# Vivado block design design_1, xczu4ev-sfvc784-1-i, Vivado 2021.1
# (continued, part 2 of 3)
current_bd_instance /user_i2c

# ---- hierarchy /Debug ----
current_bd_instance /Debug
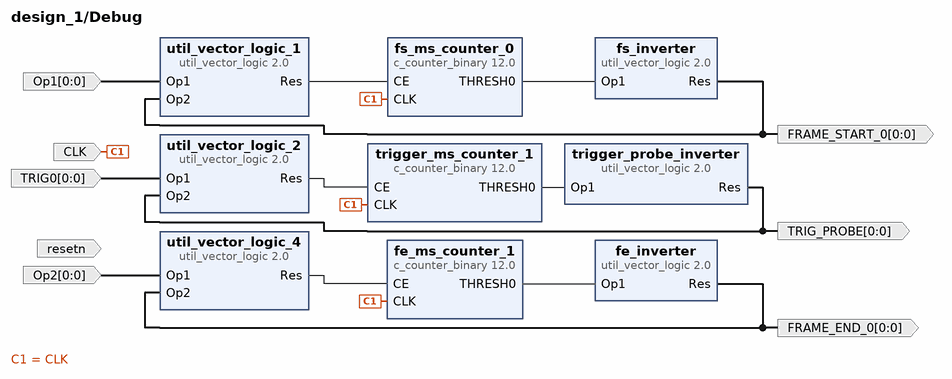
[diagram p12: block diagram inside /Debug]
create_bd_pin -dir O -from 0 -to 0 FRAME_START_0
create_bd_pin -dir O -from 0 -to 0 TRIG_PROBE
create_bd_pin -dir I -from 0 -to 0 Op1
create_bd_pin -dir O -from 0 -to 0 FRAME_END_0
create_bd_pin -dir I -from 0 -to 0 TRIG0
create_bd_pin -dir I -from 0 -to 0 Op2
create_bd_pin -dir I -type clk CLK
create_bd_pin -dir I -type rst resetn

create_bd_cell -type ip -vlnv xilinx.com:ip:util_vector_logic:2.0 fs_inverter
set_property -dict {CONFIG.C_OPERATION not CONFIG.C_SIZE 1} [get_bd_cells fs_inverter]
create_bd_cell -type ip -vlnv xilinx.com:ip:util_vector_logic:2.0 trigger_probe_inverter
set_property -dict {CONFIG.C_OPERATION not CONFIG.C_SIZE 1} [get_bd_cells trigger_probe_inverter]
create_bd_cell -type ip -vlnv xilinx.com:ip:util_vector_logic:2.0 util_vector_logic_1
set_property -dict {CONFIG.C_OPERATION or CONFIG.C_SIZE 1} [get_bd_cells util_vector_logic_1]
create_bd_cell -type ip -vlnv xilinx.com:ip:util_vector_logic:2.0 fe_inverter
set_property -dict {CONFIG.C_OPERATION not CONFIG.C_SIZE 1} [get_bd_cells fe_inverter]
create_bd_cell -type ip -vlnv xilinx.com:ip:util_vector_logic:2.0 util_vector_logic_2
set_property -dict {CONFIG.C_OPERATION or CONFIG.C_SIZE 1} [get_bd_cells util_vector_logic_2]
create_bd_cell -type ip -vlnv xilinx.com:ip:util_vector_logic:2.0 util_vector_logic_4
set_property -dict {CONFIG.C_OPERATION or CONFIG.C_SIZE 1} [get_bd_cells util_vector_logic_4]
create_bd_cell -type ip -vlnv xilinx.com:ip:c_counter_binary:12.0 trigger_ms_counter_1
set_property -dict [list \
  CONFIG.CE true \
  CONFIG.Final_Count_Value 186A0 \
  CONFIG.Implementation Fabric \
  CONFIG.Load false \
  CONFIG.Output_Width 17 \
  CONFIG.Restrict_Count true \
  CONFIG.SCLR false \
  CONFIG.Sync_Threshold_Output true \
  CONFIG.Threshold_Value 18699 \
] [get_bd_cells trigger_ms_counter_1]
create_bd_cell -type ip -vlnv xilinx.com:ip:c_counter_binary:12.0 fe_ms_counter_1
set_property -dict [list \
  CONFIG.CE true \
  CONFIG.Final_Count_Value 186A0 \
  CONFIG.Implementation Fabric \
  CONFIG.Load false \
  CONFIG.Output_Width 17 \
  CONFIG.Restrict_Count true \
  CONFIG.SCLR false \
  CONFIG.Sync_Threshold_Output true \
  CONFIG.Threshold_Value 18699 \
] [get_bd_cells fe_ms_counter_1]
create_bd_cell -type ip -vlnv xilinx.com:ip:c_counter_binary:12.0 fs_ms_counter_0
set_property -dict [list \
  CONFIG.CE true \
  CONFIG.Final_Count_Value 186A0 \
  CONFIG.Implementation Fabric \
  CONFIG.Load false \
  CONFIG.Output_Width 17 \
  CONFIG.Restrict_Count true \
  CONFIG.SCLR false \
  CONFIG.Sync_Threshold_Output true \
  CONFIG.Threshold_Value 18699 \
] [get_bd_cells fs_ms_counter_0]

# ---- connections ----

current_bd_instance /GPIO
connect_bd_net [get_bd_pins GPIO] [get_bd_pins util_ds_buf_0/IOBUF_IO_IO]
connect_bd_net [get_bd_pins USER_DIP] [get_bd_pins gpi_concat/In1]
connect_bd_net [get_bd_pins cam_enable_slice/Dout] [get_bd_pins ENABLE]
connect_bd_net [get_bd_pins gpi_concat/dout] [get_bd_pins dout]
connect_bd_net [get_bd_pins gpio_i_slice/Dout] [get_bd_pins util_ds_buf_0/IOBUF_IO_I]
connect_bd_net [get_bd_pins gpio_t_slice/Dout] [get_bd_pins util_ds_buf_0/IOBUF_IO_T]
connect_bd_net [get_bd_pins gpio_trigger_slice/Dout] [get_bd_pins TRIG0]
connect_bd_net [get_bd_pins user_led_slice/Dout] [get_bd_pins USER_LEDS]
connect_bd_net [get_bd_pins util_ds_buf_0/IOBUF_IO_O] [get_bd_pins gpi_concat/In2]
connect_bd_net -net zynq_ultra_ps_e_0_emio_gpio_o [get_bd_pins Din] \
  [get_bd_pins cam_enable_slice/Din] [get_bd_pins user_led_slice/Din] [get_bd_pins gpio_i_slice/Din] \
  [get_bd_pins gpio_trigger_slice/Din]
connect_bd_net -net zynq_ultra_ps_e_0_emio_gpio_t [get_bd_pins Din1] [get_bd_pins gpio_t_slice/Din]

current_bd_instance /mipi
connect_bd_intf_net [get_bd_intf_pins M_AXI_S2MM4] [get_bd_intf_pins cam1/M_AXI_S2MM]
connect_bd_intf_net [get_bd_intf_pins M_AXI_S2MM] [get_bd_intf_pins cam5/M_AXI_S2MM]
connect_bd_intf_net [get_bd_intf_pins iic_rtl_3] [get_bd_intf_pins cam3/iic_rtl_3]
connect_bd_intf_net [get_bd_intf_pins S_AXI] [get_bd_intf_pins line_counter/S_AXI]
connect_bd_intf_net [get_bd_intf_pins S_AXI2] [get_bd_intf_pins trigger_timer/S_AXI]
connect_bd_intf_net [get_bd_intf_pins M_AXI_S2MM1] [get_bd_intf_pins cam2/M_AXI_S2MM]
connect_bd_intf_net [get_bd_intf_pins M_AXI_S2MM2] [get_bd_intf_pins cam3/M_AXI_S2MM]
connect_bd_intf_net [get_bd_intf_pins M_AXI_S2MM3] [get_bd_intf_pins cam4/M_AXI_S2MM]
connect_bd_intf_net [get_bd_intf_pins M_AXI_S2MM5] [get_bd_intf_pins cam0/M_AXI_S2MM]
connect_bd_intf_net [get_bd_intf_pins M_AXI_S2MM6] [get_bd_intf_pins Downscaler/M_AXI_S2MM]
connect_bd_intf_net [get_bd_intf_pins S_AXI_LITE6] [get_bd_intf_pins Downscaler/S_AXI_LITE]
connect_bd_intf_net [get_bd_intf_pins M_AXI_S2MM7] [get_bd_intf_pins Downscaler/M_AXI_S2MM1]
connect_bd_intf_net [get_bd_intf_pins S_AXI_LITE7] [get_bd_intf_pins Downscaler/S_AXI_LITE1]
connect_bd_intf_net [get_bd_intf_pins M_AXI_S2MM8] [get_bd_intf_pins Downscaler/M_AXI_S2MM2]
connect_bd_intf_net [get_bd_intf_pins S_AXI_LITE8] [get_bd_intf_pins Downscaler/S_AXI_LITE2]
connect_bd_intf_net [get_bd_intf_pins M_AXI_S2MM9] [get_bd_intf_pins Downscaler/M_AXI_S2MM3]
connect_bd_intf_net [get_bd_intf_pins S_AXI_LITE9] [get_bd_intf_pins Downscaler/S_AXI_LITE3]
connect_bd_intf_net [get_bd_intf_pins M_AXI_S2MM10] [get_bd_intf_pins Downscaler/M_AXI_S2MM4]
connect_bd_intf_net [get_bd_intf_pins S_AXI_LITE10] [get_bd_intf_pins Downscaler/S_AXI_LITE4]
connect_bd_intf_net [get_bd_intf_pins s_axi_ctrl] [get_bd_intf_pins Downscaler/s_axi_ctrl]
connect_bd_intf_net [get_bd_intf_pins s_axi_ctrl1] [get_bd_intf_pins Downscaler/s_axi_ctrl1]
connect_bd_intf_net [get_bd_intf_pins s_axi_ctrl2] [get_bd_intf_pins Downscaler/s_axi_ctrl2]
connect_bd_intf_net [get_bd_intf_pins s_axi_ctrl3] [get_bd_intf_pins Downscaler/s_axi_ctrl3]
connect_bd_intf_net [get_bd_intf_pins s_axi_ctrl4] [get_bd_intf_pins Downscaler/s_axi_ctrl4]
connect_bd_intf_net [get_bd_intf_pins iic_rtl_1] [get_bd_intf_pins cam1/iic_rtl_1]
connect_bd_intf_net [get_bd_intf_pins iic_rtl_4] [get_bd_intf_pins cam4/iic_rtl_4]
connect_bd_intf_net [get_bd_intf_pins iic_rtl_5] [get_bd_intf_pins cam5/iic_rtl_5]
connect_bd_intf_net [get_bd_intf_pins cam0/M01_AXIS] [get_bd_intf_pins Downscaler/S00_AXIS]
connect_bd_intf_net [get_bd_intf_pins cam1/M01_AXIS] [get_bd_intf_pins Downscaler/S01_AXIS]
connect_bd_intf_net [get_bd_intf_pins cam2/M01_AXIS] [get_bd_intf_pins Downscaler/S02_AXIS]
connect_bd_intf_net [get_bd_intf_pins iic_rtl_2] [get_bd_intf_pins cam2/iic_rtl_2]
connect_bd_intf_net [get_bd_intf_pins cam3/M01_AXIS] [get_bd_intf_pins Downscaler/S03_AXIS]
connect_bd_intf_net [get_bd_intf_pins cam4/M01_AXIS] [get_bd_intf_pins Downscaler/S04_AXIS]
connect_bd_intf_net [get_bd_intf_pins cam5/M01_AXIS] [get_bd_intf_pins Downscaler/S05_AXIS]
connect_bd_intf_net [get_bd_intf_pins mipi_phy_if_0] [get_bd_intf_pins cam0/mipi_phy_if_0]
connect_bd_intf_net [get_bd_intf_pins mipi_phy_if_1] [get_bd_intf_pins cam1/mipi_phy_if_1]
connect_bd_intf_net [get_bd_intf_pins mipi_phy_if_2] [get_bd_intf_pins cam2/mipi_phy_if_2]
connect_bd_intf_net [get_bd_intf_pins mipi_phy_if_3] [get_bd_intf_pins cam3/mipi_phy_if_3]
connect_bd_intf_net [get_bd_intf_pins mipi_phy_if_4] [get_bd_intf_pins cam4/mipi_phy_if_4]
connect_bd_intf_net [get_bd_intf_pins mipi_phy_if_5] [get_bd_intf_pins cam5/mipi_phy_if_5]
connect_bd_intf_net [get_bd_intf_pins S_AXI_LITE5] [get_bd_intf_pins cam0/S_AXI_LITE]
connect_bd_intf_net [get_bd_intf_pins S_AXI_LITE] [get_bd_intf_pins cam1/S_AXI_LITE]
connect_bd_intf_net [get_bd_intf_pins S_AXI1] [get_bd_intf_pins cam1/S_AXI1]
connect_bd_intf_net [get_bd_intf_pins S_AXI8] [get_bd_intf_pins cam2/S_AXI]
connect_bd_intf_net [get_bd_intf_pins S_AXI10] [get_bd_intf_pins cam3/S_AXI1]
connect_bd_intf_net [get_bd_intf_pins S_AXI12] [get_bd_intf_pins cam4/S_AXI1]
connect_bd_intf_net [get_bd_intf_pins S_AXI6] [get_bd_intf_pins cam5/S_AXI1]
connect_bd_intf_net [get_bd_intf_pins S_AXI_LITE2] [get_bd_intf_pins cam2/S_AXI_LITE]
connect_bd_intf_net [get_bd_intf_pins S_AXI_LITE3] [get_bd_intf_pins cam3/S_AXI_LITE]
connect_bd_intf_net [get_bd_intf_pins S_AXI_LITE4] [get_bd_intf_pins cam4/S_AXI_LITE]
connect_bd_intf_net [get_bd_intf_pins S_AXI_LITE1] [get_bd_intf_pins cam5/S_AXI_LITE]
connect_bd_net [get_bd_pins Din] [get_bd_pins line_counter_select/Din] [get_bd_pins Downscaler/Din]
connect_bd_net [get_bd_pins aresetn] [get_bd_pins Downscaler/aresetn]
connect_bd_net -net axi_vdma_1_s2mm_introut [get_bd_pins cam1/s2mm_introut] [get_bd_pins s2mm_introut]
connect_bd_net -net axi_vdma_2_s2mm_introut1 [get_bd_pins cam2/s2mm_introut] [get_bd_pins s2mm_introut2]
connect_bd_net -net axi_vdma_3_s2mm_introut [get_bd_pins cam3/s2mm_introut] [get_bd_pins s2mm_introut3]
connect_bd_net -net axi_vdma_4_s2mm_introut [get_bd_pins cam4/s2mm_introut] [get_bd_pins s2mm_introut4]
connect_bd_net -net axi_vdma_5_s2mm_introut [get_bd_pins cam5/s2mm_introut] [get_bd_pins s2mm_introut1]
connect_bd_net [get_bd_pins cam0/video_out_tlast] [get_bd_pins end_line_concat/In0]
connect_bd_net [get_bd_pins cam1/video_out_tlast] [get_bd_pins end_line_concat/In1]
connect_bd_net -net cam2_mipi_block_two_lane_iic2intc_irpt [get_bd_pins cam2/iic2intc_irpt] [get_bd_pins iic2intc_irpt5]
connect_bd_net [get_bd_pins cam2/video_out_tlast] [get_bd_pins end_line_concat/In2]
connect_bd_net [get_bd_pins cam3/video_out_tlast] [get_bd_pins end_line_concat/In3]
connect_bd_net [get_bd_pins cam4/video_out_tlast] [get_bd_pins end_line_concat/In4]
connect_bd_net [get_bd_pins cam5/video_out_tlast] [get_bd_pins end_line_concat/In5]
connect_bd_net -net cam_iic_1_iic2intc_irpt [get_bd_pins cam1/iic2intc_irpt] [get_bd_pins iic2intc_irpt]
connect_bd_net -net cam_iic_3_iic2intc_irpt [get_bd_pins cam3/iic2intc_irpt] [get_bd_pins iic2intc_irpt6]
connect_bd_net -net cam_iic_4_iic2intc_irpt [get_bd_pins cam4/iic2intc_irpt] [get_bd_pins iic2intc_irpt7]
connect_bd_net -net cam_iic_5_iic2intc_irpt [get_bd_pins cam5/iic2intc_irpt] [get_bd_pins iic2intc_irpt4]
connect_bd_net [get_bd_pins end_line_concat/dout] [get_bd_pins selector/Op1]
connect_bd_net -net end_of_line_select_Dout [get_bd_pins line_counter_select/Dout] [get_bd_pins selector/Op2]
connect_bd_net [get_bd_pins line_counter/interrupt] [get_bd_pins interrupt6]
connect_bd_net [get_bd_pins line_end_inverter/Res] [get_bd_pins line_counter/freeze]
connect_bd_net -net mipi_block_four_lane_frame_rcvd_pulse_out [get_bd_pins cam0/frame_rcvd_pulse_out] [get_bd_pins frame_rcvd_pulse_out]
connect_bd_net -net mipi_block_four_lane_s2mm_introut [get_bd_pins cam0/s2mm_introut] [get_bd_pins s2mm_introut5]
connect_bd_net -net mipi_csi2_rx_subsyst_0_clkoutphy_out [get_bd_pins cam1/clkoutphy_out] \
  [get_bd_pins cam2/clkoutphy_in] [get_bd_pins cam4/clkoutphy_in] [get_bd_pins cam5/clkoutphy_in] [get_bd_pins clkoutphy_out]
connect_bd_net -net mipi_csi2_rx_subsyst_0_pll_lock_out [get_bd_pins cam1/pll_lock_out] \
  [get_bd_pins cam2/pll_lock_in] [get_bd_pins cam4/pll_lock_in] [get_bd_pins cam5/pll_lock_in]
connect_bd_net -net mipi_csi2_rx_subsyst_0_video_out_tuser [get_bd_pins cam0/video_out_tuser] [get_bd_pins video_out_tuser]
connect_bd_net [get_bd_pins reduce_line_counters/Res] [get_bd_pins line_end_inverter/Op1]
connect_bd_net -net rst_ps8_0_49M_peripheral_aresetn [get_bd_pins video_aresetn] \
  [get_bd_pins cam0/video_aresetn] [get_bd_pins cam2/video_aresetn] [get_bd_pins cam3/s_axi_aresetn] \
  [get_bd_pins cam4/video_aresetn] [get_bd_pins cam5/video_aresetn] [get_bd_pins cam1/axi_resetn] \
  [get_bd_pins line_counter/s_axi_aresetn] [get_bd_pins trigger_timer/s_axi_aresetn] \
  [get_bd_pins Downscaler/peripheral_aresetn]
connect_bd_net [get_bd_pins trigger_timer/pwm0] [get_bd_pins TRIG1]
connect_bd_net -net util_vector_logic_0_Res1 [get_bd_pins selector/Res] [get_bd_pins reduce_line_counters/Op1]
connect_bd_net [get_bd_pins xlconstant_0/dout] \
  [get_bd_pins cam0/ctrl_core_en] [get_bd_pins cam2/ctrl_core_en] [get_bd_pins cam3/ctrl_core_en] \
  [get_bd_pins cam4/ctrl_core_en] [get_bd_pins cam5/ctrl_core_en] [get_bd_pins cam1/ctrl_core_en]
connect_bd_net [get_bd_pins xlconstant_1/dout] [get_bd_pins dout1]
connect_bd_net [get_bd_pins xlconstant_2/dout] [get_bd_pins dout]
connect_bd_net -net zynq_ultra_ps_e_0_pl_clk0 [get_bd_pins dphy_clk_200M] \
  [get_bd_pins cam0/dphy_clk_200M] [get_bd_pins cam2/dphy_clk_200M] [get_bd_pins cam3/dphy_clk_200M] \
  [get_bd_pins cam4/dphy_clk_200M] [get_bd_pins cam5/dphy_clk_200M] [get_bd_pins cam1/dphy_clk_200M]
connect_bd_net -net zynq_ultra_ps_e_0_pl_clk1 [get_bd_pins video_aclk] \
  [get_bd_pins cam0/video_aclk] [get_bd_pins cam2/video_aclk] [get_bd_pins cam3/s_axi_aclk] [get_bd_pins cam4/video_aclk] \
  [get_bd_pins cam5/video_aclk] [get_bd_pins cam1/s_axi_lite_aclk] [get_bd_pins line_counter/s_axi_aclk] \
  [get_bd_pins trigger_timer/s_axi_aclk] [get_bd_pins Downscaler/pl_clk1] [get_bd_pins Downscaler/pl_clk0]

current_bd_instance /mipi/cam1
connect_bd_intf_net [get_bd_intf_pins iic_rtl_1] [get_bd_intf_pins iic/IIC]
connect_bd_intf_net [get_bd_intf_pins M_AXI_S2MM] [get_bd_intf_pins axi_vdma/M_AXI_S2MM]
connect_bd_intf_net [get_bd_intf_pins axis_broadcaster/M00_AXIS] [get_bd_intf_pins axi_vdma/S_AXIS_S2MM]
connect_bd_intf_net [get_bd_intf_pins M01_AXIS] [get_bd_intf_pins axis_broadcaster/M01_AXIS]
connect_bd_intf_net [get_bd_intf_pins mipi_csi2_rx_subsystem/video_out] [get_bd_intf_pins axis_broadcaster/S_AXIS]
connect_bd_intf_net [get_bd_intf_pins mipi_phy_if_1] [get_bd_intf_pins mipi_csi2_rx_subsystem/mipi_phy_if]
connect_bd_intf_net [get_bd_intf_pins S_AXI_LITE] [get_bd_intf_pins axi_vdma/S_AXI_LITE]
connect_bd_intf_net [get_bd_intf_pins S_AXI1] [get_bd_intf_pins iic/S_AXI]
connect_bd_net -net axi_vdma_1_s2mm_introut [get_bd_pins axi_vdma/s2mm_introut] [get_bd_pins s2mm_introut]
connect_bd_net -net cam_iic_1_iic2intc_irpt [get_bd_pins iic/iic2intc_irpt] [get_bd_pins iic2intc_irpt]
connect_bd_net -net mipi_csi2_rx_subsyst_0_clkoutphy_out [get_bd_pins mipi_csi2_rx_subsystem/clkoutphy_out] [get_bd_pins clkoutphy_out]
connect_bd_net -net mipi_csi2_rx_subsyst_0_pll_lock_out [get_bd_pins mipi_csi2_rx_subsystem/pll_lock_out] [get_bd_pins pll_lock_out]
connect_bd_net [get_bd_pins mipi_csi2_rx_subsystem/video_out_tlast] [get_bd_pins video_out_tlast]
connect_bd_net -net rst_ps8_0_49M_peripheral_aresetn [get_bd_pins axi_resetn] \
  [get_bd_pins axi_vdma/axi_resetn] [get_bd_pins iic/s_axi_aresetn] [get_bd_pins mipi_csi2_rx_subsystem/video_aresetn] \
  [get_bd_pins axis_broadcaster/aresetn]
connect_bd_net -net xlconstant_0_dout [get_bd_pins ctrl_core_en] [get_bd_pins mipi_csi2_rx_subsystem/ctrl_core_en]
connect_bd_net -net zynq_ultra_ps_e_0_pl_clk0 [get_bd_pins dphy_clk_200M] [get_bd_pins mipi_csi2_rx_subsystem/dphy_clk_200M]
connect_bd_net -net zynq_ultra_ps_e_0_pl_clk1 [get_bd_pins s_axi_lite_aclk] \
  [get_bd_pins axi_vdma/s_axi_lite_aclk] [get_bd_pins axi_vdma/m_axi_s2mm_aclk] [get_bd_pins axi_vdma/s_axis_s2mm_aclk] \
  [get_bd_pins iic/s_axi_aclk] [get_bd_pins mipi_csi2_rx_subsystem/video_aclk] [get_bd_pins axis_broadcaster/aclk]

current_bd_instance /mipi/cam5
connect_bd_intf_net [get_bd_intf_pins iic_rtl_5] [get_bd_intf_pins iic/IIC]
connect_bd_intf_net [get_bd_intf_pins M_AXI_S2MM] [get_bd_intf_pins axi_vdma/M_AXI_S2MM]
connect_bd_intf_net [get_bd_intf_pins axis_broadcaster/M00_AXIS] [get_bd_intf_pins axi_vdma/S_AXIS_S2MM]
connect_bd_intf_net [get_bd_intf_pins M01_AXIS] [get_bd_intf_pins axis_broadcaster/M01_AXIS]
connect_bd_intf_net [get_bd_intf_pins mipi_csi2_rx_subsystem/video_out] [get_bd_intf_pins axis_broadcaster/S_AXIS]
connect_bd_intf_net [get_bd_intf_pins mipi_phy_if_5] [get_bd_intf_pins mipi_csi2_rx_subsystem/mipi_phy_if]
connect_bd_intf_net [get_bd_intf_pins S_AXI1] [get_bd_intf_pins iic/S_AXI]
connect_bd_intf_net [get_bd_intf_pins S_AXI_LITE] [get_bd_intf_pins axi_vdma/S_AXI_LITE]
connect_bd_net -net axi_vdma_5_s2mm_introut [get_bd_pins axi_vdma/s2mm_introut] [get_bd_pins s2mm_introut]
connect_bd_net -net cam_iic_5_iic2intc_irpt [get_bd_pins iic/iic2intc_irpt] [get_bd_pins iic2intc_irpt]
connect_bd_net [get_bd_pins clkoutphy_in] [get_bd_pins mipi_csi2_rx_subsystem/clkoutphy_in]
connect_bd_net [get_bd_pins mipi_csi2_rx_subsystem/video_out_tlast] [get_bd_pins video_out_tlast]
connect_bd_net [get_bd_pins pll_lock_in] [get_bd_pins mipi_csi2_rx_subsystem/pll_lock_in]
connect_bd_net -net rst_ps8_0_49M_peripheral_aresetn [get_bd_pins video_aresetn] \
  [get_bd_pins axi_vdma/axi_resetn] [get_bd_pins iic/s_axi_aresetn] [get_bd_pins mipi_csi2_rx_subsystem/video_aresetn] \
  [get_bd_pins axis_broadcaster/aresetn]
connect_bd_net -net xlconstant_0_dout [get_bd_pins ctrl_core_en] [get_bd_pins mipi_csi2_rx_subsystem/ctrl_core_en]
connect_bd_net -net zynq_ultra_ps_e_0_pl_clk0 [get_bd_pins dphy_clk_200M] [get_bd_pins mipi_csi2_rx_subsystem/dphy_clk_200M]
connect_bd_net -net zynq_ultra_ps_e_0_pl_clk1 [get_bd_pins video_aclk] \
  [get_bd_pins axi_vdma/s_axi_lite_aclk] [get_bd_pins axi_vdma/m_axi_s2mm_aclk] [get_bd_pins axi_vdma/s_axis_s2mm_aclk] \
  [get_bd_pins iic/s_axi_aclk] [get_bd_pins mipi_csi2_rx_subsystem/video_aclk] [get_bd_pins axis_broadcaster/aclk]

current_bd_instance /mipi/cam2
connect_bd_intf_net [get_bd_intf_pins S_AXI] [get_bd_intf_pins iic/S_AXI]
connect_bd_intf_net [get_bd_intf_pins iic_rtl_2] [get_bd_intf_pins iic/IIC]
connect_bd_intf_net [get_bd_intf_pins M_AXI_S2MM] [get_bd_intf_pins axi_vdma/M_AXI_S2MM]
connect_bd_intf_net [get_bd_intf_pins axis_broadcaster/M00_AXIS] [get_bd_intf_pins axi_vdma/S_AXIS_S2MM]
connect_bd_intf_net [get_bd_intf_pins M01_AXIS] [get_bd_intf_pins axis_broadcaster/M01_AXIS]
connect_bd_intf_net [get_bd_intf_pins mipi_csi2_rx_subsystem/video_out] [get_bd_intf_pins axis_broadcaster/S_AXIS]
connect_bd_intf_net [get_bd_intf_pins mipi_phy_if_2] [get_bd_intf_pins mipi_csi2_rx_subsystem/mipi_phy_if]
connect_bd_intf_net [get_bd_intf_pins S_AXI_LITE] [get_bd_intf_pins axi_vdma/S_AXI_LITE]
connect_bd_net -net axi_vdma_2_s2mm_introut1 [get_bd_pins axi_vdma/s2mm_introut] [get_bd_pins s2mm_introut]
connect_bd_net -net cam_iic_2_iic2intc_irpt [get_bd_pins iic/iic2intc_irpt] [get_bd_pins iic2intc_irpt]
connect_bd_net [get_bd_pins clkoutphy_in] [get_bd_pins mipi_csi2_rx_subsystem/clkoutphy_in]
connect_bd_net [get_bd_pins mipi_csi2_rx_subsystem/video_out_tlast] [get_bd_pins video_out_tlast]
connect_bd_net [get_bd_pins pll_lock_in] [get_bd_pins mipi_csi2_rx_subsystem/pll_lock_in]
connect_bd_net -net rst_ps8_0_49M_peripheral_aresetn [get_bd_pins video_aresetn] \
  [get_bd_pins axi_vdma/axi_resetn] [get_bd_pins iic/s_axi_aresetn] [get_bd_pins mipi_csi2_rx_subsystem/video_aresetn] \
  [get_bd_pins axis_broadcaster/aresetn]
# net s2mm_frame_ptr_out has one end: axi_vdma/s2mm_frame_ptr_out
connect_bd_net -net xlconstant_0_dout [get_bd_pins ctrl_core_en] [get_bd_pins mipi_csi2_rx_subsystem/ctrl_core_en]
connect_bd_net -net zynq_ultra_ps_e_0_pl_clk0 [get_bd_pins dphy_clk_200M] [get_bd_pins mipi_csi2_rx_subsystem/dphy_clk_200M]
connect_bd_net -net zynq_ultra_ps_e_0_pl_clk1 [get_bd_pins video_aclk] \
  [get_bd_pins axi_vdma/s_axi_lite_aclk] [get_bd_pins axi_vdma/m_axi_s2mm_aclk] [get_bd_pins axi_vdma/s_axis_s2mm_aclk] \
  [get_bd_pins iic/s_axi_aclk] [get_bd_pins mipi_csi2_rx_subsystem/video_aclk] [get_bd_pins axis_broadcaster/aclk]

current_bd_instance /mipi/cam3
connect_bd_intf_net [get_bd_intf_pins M_AXI_S2MM] [get_bd_intf_pins axi_vdma/M_AXI_S2MM]
connect_bd_intf_net [get_bd_intf_pins axis_broadcaster/M00_AXIS] [get_bd_intf_pins axi_vdma/S_AXIS_S2MM]
connect_bd_intf_net [get_bd_intf_pins M01_AXIS] [get_bd_intf_pins axis_broadcaster/M01_AXIS]
connect_bd_intf_net [get_bd_intf_pins iic_rtl_3] [get_bd_intf_pins iic/IIC]
connect_bd_intf_net [get_bd_intf_pins axis_broadcaster/S_AXIS] [get_bd_intf_pins mipi_csi2_rx_subsystem/video_out]
connect_bd_intf_net [get_bd_intf_pins mipi_phy_if_3] [get_bd_intf_pins mipi_csi2_rx_subsystem/mipi_phy_if]
connect_bd_intf_net [get_bd_intf_pins S_AXI1] [get_bd_intf_pins iic/S_AXI]
connect_bd_intf_net [get_bd_intf_pins S_AXI_LITE] [get_bd_intf_pins axi_vdma/S_AXI_LITE]
connect_bd_net -net axi_vdma_3_s2mm_introut [get_bd_pins axi_vdma/s2mm_introut] [get_bd_pins s2mm_introut]
connect_bd_net -net cam_iic_3_iic2intc_irpt [get_bd_pins iic/iic2intc_irpt] [get_bd_pins iic2intc_irpt]
connect_bd_net [get_bd_pins mipi_csi2_rx_subsystem/video_out_tlast] [get_bd_pins video_out_tlast]
connect_bd_net -net rst_ps8_0_49M_peripheral_aresetn [get_bd_pins s_axi_aresetn] \
  [get_bd_pins axi_vdma/axi_resetn] [get_bd_pins iic/s_axi_aresetn] [get_bd_pins mipi_csi2_rx_subsystem/video_aresetn] \
  [get_bd_pins axis_broadcaster/aresetn]
connect_bd_net -net xlconstant_0_dout [get_bd_pins ctrl_core_en] [get_bd_pins mipi_csi2_rx_subsystem/ctrl_core_en]
connect_bd_net -net zynq_ultra_ps_e_0_pl_clk0 [get_bd_pins dphy_clk_200M] [get_bd_pins mipi_csi2_rx_subsystem/dphy_clk_200M]
connect_bd_net -net zynq_ultra_ps_e_0_pl_clk1 [get_bd_pins s_axi_aclk] \
  [get_bd_pins axi_vdma/s_axi_lite_aclk] [get_bd_pins axi_vdma/m_axi_s2mm_aclk] [get_bd_pins axi_vdma/s_axis_s2mm_aclk] \
  [get_bd_pins iic/s_axi_aclk] [get_bd_pins mipi_csi2_rx_subsystem/video_aclk] [get_bd_pins axis_broadcaster/aclk]

current_bd_instance /mipi/cam4
connect_bd_intf_net [get_bd_intf_pins iic_rtl_4] [get_bd_intf_pins iic/IIC]
connect_bd_intf_net [get_bd_intf_pins M_AXI_S2MM] [get_bd_intf_pins axi_vdma/M_AXI_S2MM]
connect_bd_intf_net [get_bd_intf_pins axis_broadcaster/M00_AXIS] [get_bd_intf_pins axi_vdma/S_AXIS_S2MM]
connect_bd_intf_net [get_bd_intf_pins M01_AXIS] [get_bd_intf_pins axis_broadcaster/M01_AXIS]
connect_bd_intf_net [get_bd_intf_pins mipi_csi2_rx_subsystem/video_out] [get_bd_intf_pins axis_broadcaster/S_AXIS]
connect_bd_intf_net [get_bd_intf_pins mipi_phy_if_4] [get_bd_intf_pins mipi_csi2_rx_subsystem/mipi_phy_if]
connect_bd_intf_net [get_bd_intf_pins S_AXI1] [get_bd_intf_pins iic/S_AXI]
connect_bd_intf_net [get_bd_intf_pins S_AXI_LITE] [get_bd_intf_pins axi_vdma/S_AXI_LITE]
connect_bd_net -net axi_vdma_4_s2mm_introut [get_bd_pins axi_vdma/s2mm_introut] [get_bd_pins s2mm_introut]
connect_bd_net -net cam_iic_4_iic2intc_irpt [get_bd_pins iic/iic2intc_irpt] [get_bd_pins iic2intc_irpt]
connect_bd_net -net mipi_csi2_rx_subsyst_0_clkoutphy_out [get_bd_pins clkoutphy_in] [get_bd_pins mipi_csi2_rx_subsystem/clkoutphy_in]
connect_bd_net -net mipi_csi2_rx_subsyst_0_pll_lock_out [get_bd_pins pll_lock_in] [get_bd_pins mipi_csi2_rx_subsystem/pll_lock_in]
connect_bd_net [get_bd_pins mipi_csi2_rx_subsystem/video_out_tlast] [get_bd_pins video_out_tlast]
connect_bd_net -net rst_ps8_0_49M_peripheral_aresetn [get_bd_pins video_aresetn] \
  [get_bd_pins axi_vdma/axi_resetn] [get_bd_pins iic/s_axi_aresetn] [get_bd_pins mipi_csi2_rx_subsystem/video_aresetn] \
  [get_bd_pins axis_broadcaster/aresetn]
connect_bd_net -net xlconstant_0_dout [get_bd_pins ctrl_core_en] [get_bd_pins mipi_csi2_rx_subsystem/ctrl_core_en]
connect_bd_net -net zynq_ultra_ps_e_0_pl_clk0 [get_bd_pins dphy_clk_200M] [get_bd_pins mipi_csi2_rx_subsystem/dphy_clk_200M]
connect_bd_net -net zynq_ultra_ps_e_0_pl_clk1 [get_bd_pins video_aclk] \
  [get_bd_pins axi_vdma/s_axi_lite_aclk] [get_bd_pins axi_vdma/m_axi_s2mm_aclk] [get_bd_pins axi_vdma/s_axis_s2mm_aclk] \
  [get_bd_pins iic/s_axi_aclk] [get_bd_pins mipi_csi2_rx_subsystem/video_aclk] [get_bd_pins axis_broadcaster/aclk]

current_bd_instance /mipi/cam0
connect_bd_intf_net [get_bd_intf_pins M_AXI_S2MM] [get_bd_intf_pins axi_vdma/M_AXI_S2MM]
connect_bd_intf_net [get_bd_intf_pins mipi_phy_if_0] [get_bd_intf_pins mipi_csi2_rx_subsystem/mipi_phy_if]
connect_bd_intf_net [get_bd_intf_pins S_AXI_LITE] [get_bd_intf_pins axi_vdma/S_AXI_LITE]
connect_bd_intf_net [get_bd_intf_pins axis_broadcaster/M00_AXIS] [get_bd_intf_pins axi_vdma/S_AXIS_S2MM]
connect_bd_intf_net [get_bd_intf_pins M01_AXIS] [get_bd_intf_pins axis_broadcaster/M01_AXIS]
connect_bd_intf_net [get_bd_intf_pins mipi_csi2_rx_subsystem/video_out] [get_bd_intf_pins axis_broadcaster/S_AXIS]
connect_bd_net -net axi_vdma_0_s2mm_introut [get_bd_pins axi_vdma/s2mm_introut] [get_bd_pins s2mm_introut]
connect_bd_net [get_bd_pins ctrl_core_en] [get_bd_pins mipi_csi2_rx_subsystem/ctrl_core_en]
connect_bd_net [get_bd_pins dphy_clk_200M] [get_bd_pins mipi_csi2_rx_subsystem/dphy_clk_200M]
connect_bd_net -net mipi_csi2_rx_subsyst_0_frame_rcvd_pulse_out [get_bd_pins mipi_csi2_rx_subsystem/frame_rcvd_pulse_out] \
  [get_bd_pins frame_rcvd_pulse_out]
connect_bd_net [get_bd_pins mipi_csi2_rx_subsystem/video_out_tlast] [get_bd_pins video_out_tlast]
connect_bd_net [get_bd_pins video_aclk] \
  [get_bd_pins axi_vdma/s_axi_lite_aclk] [get_bd_pins axi_vdma/m_axi_s2mm_aclk] [get_bd_pins axi_vdma/s_axis_s2mm_aclk] \
  [get_bd_pins mipi_csi2_rx_subsystem/video_aclk] [get_bd_pins axis_broadcaster/aclk]
connect_bd_net [get_bd_pins video_aresetn] \
  [get_bd_pins axi_vdma/axi_resetn] [get_bd_pins mipi_csi2_rx_subsystem/video_aresetn] [get_bd_pins axis_broadcaster/aresetn]

current_bd_instance /mipi/Downscaler
connect_bd_intf_net [get_bd_intf_pins M_AXI_S2MM] [get_bd_intf_pins axi_vdma/M_AXI_S2MM]
connect_bd_intf_net [get_bd_intf_pins S_AXI_LITE] [get_bd_intf_pins axi_vdma/S_AXI_LITE]
connect_bd_intf_net [get_bd_intf_pins M_AXI_S2MM1] [get_bd_intf_pins axi_vdma1/M_AXI_S2MM]
connect_bd_intf_net [get_bd_intf_pins S_AXI_LITE1] [get_bd_intf_pins axi_vdma1/S_AXI_LITE]
connect_bd_intf_net [get_bd_intf_pins M_AXI_S2MM2] [get_bd_intf_pins axi_vdma2/M_AXI_S2MM]
connect_bd_intf_net [get_bd_intf_pins S_AXI_LITE2] [get_bd_intf_pins axi_vdma2/S_AXI_LITE]
connect_bd_intf_net [get_bd_intf_pins M_AXI_S2MM3] [get_bd_intf_pins axi_vdma3/M_AXI_S2MM]
connect_bd_intf_net [get_bd_intf_pins S_AXI_LITE3] [get_bd_intf_pins axi_vdma3/S_AXI_LITE]
connect_bd_intf_net [get_bd_intf_pins M_AXI_S2MM4] [get_bd_intf_pins axi_vdma4/M_AXI_S2MM]
connect_bd_intf_net [get_bd_intf_pins S_AXI_LITE4] [get_bd_intf_pins axi_vdma4/S_AXI_LITE]
connect_bd_intf_net [get_bd_intf_pins s_axi_ctrl] [get_bd_intf_pins v_proc_ss_0/s_axi_ctrl]
connect_bd_intf_net [get_bd_intf_pins s_axi_ctrl1] [get_bd_intf_pins v_proc_ss_1/s_axi_ctrl]
connect_bd_intf_net [get_bd_intf_pins s_axi_ctrl2] [get_bd_intf_pins v_proc_ss_2/s_axi_ctrl]
connect_bd_intf_net [get_bd_intf_pins s_axi_ctrl3] [get_bd_intf_pins v_proc_ss_3/s_axi_ctrl]
connect_bd_intf_net [get_bd_intf_pins s_axi_ctrl4] [get_bd_intf_pins v_proc_ss_4/s_axi_ctrl]
connect_bd_intf_net [get_bd_intf_pins S00_AXIS] [get_bd_intf_pins axis_switch_0/S00_AXIS]
connect_bd_intf_net [get_bd_intf_pins S01_AXIS] [get_bd_intf_pins axis_switch_0/S01_AXIS]
connect_bd_intf_net [get_bd_intf_pins S02_AXIS] [get_bd_intf_pins axis_switch_0/S02_AXIS]
connect_bd_intf_net [get_bd_intf_pins S03_AXIS] [get_bd_intf_pins axis_switch_0/S03_AXIS]
connect_bd_intf_net [get_bd_intf_pins S04_AXIS] [get_bd_intf_pins axis_switch_0/S04_AXIS]
connect_bd_intf_net [get_bd_intf_pins S05_AXIS] [get_bd_intf_pins axis_switch_0/S05_AXIS]
connect_bd_intf_net [get_bd_intf_pins axis_broadcaster_0/M00_AXIS] [get_bd_intf_pins v_proc_ss_1/s_axis]
connect_bd_intf_net [get_bd_intf_pins axis_broadcaster_0/M01_AXIS] [get_bd_intf_pins axi_vdma/S_AXIS_S2MM]
connect_bd_intf_net [get_bd_intf_pins axi_vdma1/S_AXIS_S2MM] [get_bd_intf_pins axis_broadcaster_1/M00_AXIS]
connect_bd_intf_net [get_bd_intf_pins v_proc_ss_2/s_axis] [get_bd_intf_pins axis_broadcaster_1/M01_AXIS]
connect_bd_intf_net [get_bd_intf_pins axis_broadcaster_2/M00_AXIS] [get_bd_intf_pins axi_vdma2/S_AXIS_S2MM]
connect_bd_intf_net [get_bd_intf_pins axis_broadcaster_2/M01_AXIS] [get_bd_intf_pins v_proc_ss_3/s_axis]
connect_bd_intf_net [get_bd_intf_pins axis_broadcaster_3/M00_AXIS] [get_bd_intf_pins axi_vdma3/S_AXIS_S2MM]
connect_bd_intf_net [get_bd_intf_pins axis_broadcaster_3/M01_AXIS] [get_bd_intf_pins v_proc_ss_4/s_axis]
connect_bd_intf_net [get_bd_intf_pins axis_switch_0/M00_AXIS] [get_bd_intf_pins v_proc_ss_0/s_axis]
connect_bd_intf_net [get_bd_intf_pins v_proc_ss_0/m_axis] [get_bd_intf_pins axis_broadcaster_0/S_AXIS]
connect_bd_intf_net [get_bd_intf_pins v_proc_ss_1/m_axis] [get_bd_intf_pins axis_broadcaster_1/S_AXIS]
connect_bd_intf_net [get_bd_intf_pins v_proc_ss_2/m_axis] [get_bd_intf_pins axis_broadcaster_2/S_AXIS]
connect_bd_intf_net [get_bd_intf_pins v_proc_ss_3/m_axis] [get_bd_intf_pins axis_broadcaster_3/S_AXIS]
connect_bd_intf_net [get_bd_intf_pins v_proc_ss_4/m_axis] [get_bd_intf_pins axi_vdma4/S_AXIS_S2MM]
connect_bd_net [get_bd_pins Din] [get_bd_pins rescale_select/Din]
connect_bd_net [get_bd_pins aresetn] [get_bd_pins axis_broadcaster_0/aresetn]
connect_bd_net [get_bd_pins peripheral_aresetn] \
  [get_bd_pins axis_switch_0/aresetn] [get_bd_pins axi_vdma/axi_resetn] [get_bd_pins axi_vdma1/axi_resetn] \
  [get_bd_pins axi_vdma2/axi_resetn] [get_bd_pins axis_broadcaster_2/aresetn] [get_bd_pins axi_vdma3/axi_resetn] \
  [get_bd_pins axis_broadcaster_3/aresetn] [get_bd_pins axi_vdma4/axi_resetn] [get_bd_pins v_proc_ss_0/aresetn_ctrl] \
  [get_bd_pins v_proc_ss_1/aresetn_ctrl] [get_bd_pins v_proc_ss_2/aresetn_ctrl] [get_bd_pins v_proc_ss_3/aresetn_ctrl] \
  [get_bd_pins v_proc_ss_4/aresetn_ctrl]
connect_bd_net -net pl_clk0_1 [get_bd_pins pl_clk0] \
  [get_bd_pins v_proc_ss_0/aclk_axis] [get_bd_pins v_proc_ss_1/aclk_axis] [get_bd_pins v_proc_ss_2/aclk_axis] \
  [get_bd_pins v_proc_ss_3/aclk_axis]
connect_bd_net -net pl_clk1_1 [get_bd_pins pl_clk1] \
  [get_bd_pins axis_switch_0/aclk] [get_bd_pins axi_vdma/m_axi_s2mm_aclk] [get_bd_pins axi_vdma/s_axi_lite_aclk] \
  [get_bd_pins axi_vdma/s_axis_s2mm_aclk] [get_bd_pins axis_broadcaster_0/aclk] [get_bd_pins axi_vdma1/m_axi_s2mm_aclk] \
  [get_bd_pins axi_vdma1/s_axi_lite_aclk] [get_bd_pins axi_vdma1/s_axis_s2mm_aclk] [get_bd_pins axis_broadcaster_1/aclk] \
  [get_bd_pins axi_vdma2/m_axi_s2mm_aclk] [get_bd_pins axi_vdma2/s_axi_lite_aclk] [get_bd_pins axi_vdma2/s_axis_s2mm_aclk] \
  [get_bd_pins axis_broadcaster_2/aclk] [get_bd_pins axi_vdma3/m_axi_s2mm_aclk] [get_bd_pins axi_vdma3/s_axi_lite_aclk] \
  [get_bd_pins axi_vdma3/s_axis_s2mm_aclk] [get_bd_pins axis_broadcaster_3/aclk] [get_bd_pins axi_vdma4/m_axi_s2mm_aclk] \
  [get_bd_pins axi_vdma4/s_axi_lite_aclk] [get_bd_pins axi_vdma4/s_axis_s2mm_aclk] [get_bd_pins v_proc_ss_4/aclk_axis] \
  [get_bd_pins v_proc_ss_0/aclk_ctrl] [get_bd_pins v_proc_ss_1/aclk_ctrl] [get_bd_pins v_proc_ss_2/aclk_ctrl] \
  [get_bd_pins v_proc_ss_3/aclk_ctrl] [get_bd_pins v_proc_ss_4/aclk_ctrl]
connect_bd_net [get_bd_pins rescale_select/Dout] [get_bd_pins axis_switch_0/s_req_suppress]
connect_bd_net [get_bd_pins v_proc_ss_1/aresetn_io_axis] [get_bd_pins axis_broadcaster_1/aresetn]

current_bd_instance /interrupts
connect_bd_net -net In12_1 [get_bd_pins In6] [get_bd_pins irq0_concat/In6]
connect_bd_net -net In13_1 [get_bd_pins In7] [get_bd_pins irq0_concat/In7]
connect_bd_net -net In14_1 [get_bd_pins In14] [get_bd_pins irq1_concat/In6]
connect_bd_net -net In2_1 [get_bd_pins In0] [get_bd_pins irq0_concat/In0]
connect_bd_net -net axi_vdma_1_s2mm_introut [get_bd_pins In9] [get_bd_pins irq1_concat/In1]
connect_bd_net -net axi_vdma_2_s2mm_introut1 [get_bd_pins In10] [get_bd_pins irq1_concat/In2]
connect_bd_net -net axi_vdma_3_s2mm_introut [get_bd_pins In11] [get_bd_pins irq1_concat/In3]
connect_bd_net -net axi_vdma_4_s2mm_introut [get_bd_pins In12] [get_bd_pins irq1_concat/In4]
connect_bd_net -net axi_vdma_5_s2mm_introut [get_bd_pins In13] [get_bd_pins irq1_concat/In5]
connect_bd_net -net cam2_mipi_block_two_lane_iic2intc_irpt [get_bd_pins In2] [get_bd_pins irq0_concat/In2]
connect_bd_net -net cam_iic_1_iic2intc_irpt [get_bd_pins In1] [get_bd_pins irq0_concat/In1]
connect_bd_net -net cam_iic_3_iic2intc_irpt [get_bd_pins In3] [get_bd_pins irq0_concat/In3]
connect_bd_net -net cam_iic_4_iic2intc_irpt [get_bd_pins In4] [get_bd_pins irq0_concat/In4]
connect_bd_net -net cam_iic_5_iic2intc_irpt [get_bd_pins In5] [get_bd_pins irq0_concat/In5]
connect_bd_net -net mipi_block_four_lane_s2mm_introut [get_bd_pins In8] [get_bd_pins irq1_concat/In0]
connect_bd_net -net xlconcat_1_dout [get_bd_pins irq1_concat/dout] [get_bd_pins irq1]
connect_bd_net -net xlconcat_2_dout [get_bd_pins irq0_concat/dout] [get_bd_pins irq0]

current_bd_instance /user_i2c
connect_bd_intf_net [get_bd_intf_pins S_AXI2] [get_bd_intf_pins qwiic_iic_0/S_AXI]
connect_bd_intf_net [get_bd_intf_pins S_AXI] [get_bd_intf_pins qwiic_iic_1/S_AXI]
connect_bd_intf_net [get_bd_intf_pins S_AXI1] [get_bd_intf_pins qwiic_iic_2/S_AXI]
connect_bd_intf_net [get_bd_intf_pins qwiic_rtl_0] [get_bd_intf_pins qwiic_iic_0/IIC]
connect_bd_intf_net [get_bd_intf_pins qwiic_rtl_1] [get_bd_intf_pins qwiic_iic_1/IIC]
connect_bd_intf_net [get_bd_intf_pins qwiic_rtl_2] [get_bd_intf_pins qwiic_iic_2/IIC]
connect_bd_net [get_bd_pins qwiic_iic_0/iic2intc_irpt] [get_bd_pins iic2intc_irpt2]
connect_bd_net [get_bd_pins qwiic_iic_1/iic2intc_irpt] [get_bd_pins iic2intc_irpt]
connect_bd_net [get_bd_pins qwiic_iic_2/iic2intc_irpt] [get_bd_pins iic2intc_irpt1]
connect_bd_net -net rst_ps8_0_49M_peripheral_aresetn [get_bd_pins s_axi_aresetn] \
  [get_bd_pins qwiic_iic_0/s_axi_aresetn] [get_bd_pins qwiic_iic_1/s_axi_aresetn] [get_bd_pins qwiic_iic_2/s_axi_aresetn]
connect_bd_net -net zynq_ultra_ps_e_0_pl_clk1 [get_bd_pins s_axi_aclk] \
  [get_bd_pins qwiic_iic_0/s_axi_aclk] [get_bd_pins qwiic_iic_1/s_axi_aclk] [get_bd_pins qwiic_iic_2/s_axi_aclk]

current_bd_instance /Debug
connect_bd_net -net gpio_trigger_slice_Dout [get_bd_pins TRIG0] [get_bd_pins util_vector_logic_2/Op1]
connect_bd_net -net mipi_block_four_lane_frame_rcvd_pulse_out [get_bd_pins Op2] [get_bd_pins util_vector_logic_4/Op1]
connect_bd_net -net mipi_csi2_rx_subsyst_0_video_out_tuser [get_bd_pins Op1] [get_bd_pins util_vector_logic_1/Op1]
connect_bd_net -net ms_counter_0_THRESH0 [get_bd_pins fs_ms_counter_0/THRESH0] [get_bd_pins fs_inverter/Op1]
connect_bd_net -net ms_counter_1_THRESH0 [get_bd_pins fe_ms_counter_1/THRESH0] [get_bd_pins fe_inverter/Op1]
# net resetn_1 has one end: resetn
connect_bd_net [get_bd_pins trigger_ms_counter_1/THRESH0] [get_bd_pins trigger_probe_inverter/Op1]
connect_bd_net [get_bd_pins trigger_probe_inverter/Res] [get_bd_pins TRIG_PROBE] [get_bd_pins util_vector_logic_2/Op2]
connect_bd_net [get_bd_pins util_vector_logic_1/Res] [get_bd_pins fs_ms_counter_0/CE]
connect_bd_net -net util_vector_logic_2_Res [get_bd_pins fs_inverter/Res] [get_bd_pins FRAME_START_0] [get_bd_pins util_vector_logic_1/Op2]
connect_bd_net [get_bd_pins util_vector_logic_2/Res] [get_bd_pins trigger_ms_counter_1/CE]
connect_bd_net -net util_vector_logic_3_Res [get_bd_pins fe_inverter/Res] [get_bd_pins FRAME_END_0] [get_bd_pins util_vector_logic_4/Op2]
connect_bd_net [get_bd_pins util_vector_logic_4/Res] [get_bd_pins fe_ms_counter_1/CE]
connect_bd_net -net zynq_ultra_ps_e_0_pl_clk1 [get_bd_pins CLK] \
  [get_bd_pins fe_ms_counter_1/CLK] [get_bd_pins fs_ms_counter_0/CLK] [get_bd_pins trigger_ms_counter_1/CLK]

current_bd_instance /
connect_bd_intf_net [get_bd_intf_ports iic_rtl_3] [get_bd_intf_pins mipi/iic_rtl_3]
connect_bd_intf_net [get_bd_intf_ports iic_rtl_1] [get_bd_intf_pins mipi/iic_rtl_1]
connect_bd_intf_net [get_bd_intf_ports iic_rtl_4] [get_bd_intf_pins mipi/iic_rtl_4]
connect_bd_intf_net [get_bd_intf_ports iic_rtl_5] [get_bd_intf_pins mipi/iic_rtl_5]
connect_bd_intf_net [get_bd_intf_pins zynq_ultra_ps_e_0/S_AXI_HPC1_FPD] [get_bd_intf_pins axi_smc_1/M00_AXI]
connect_bd_intf_net [get_bd_intf_pins zynq_ultra_ps_e_0/S_AXI_HPC0_FPD] [get_bd_intf_pins axi_smc/M00_AXI]
connect_bd_intf_net [get_bd_intf_ports iic_rtl_2] [get_bd_intf_pins mipi/iic_rtl_2]
connect_bd_intf_net [get_bd_intf_pins axi_smc_1/S03_AXI] [get_bd_intf_pins mipi/M_AXI_S2MM]
connect_bd_intf_net [get_bd_intf_pins axi_smc_1/S00_AXI] [get_bd_intf_pins mipi/M_AXI_S2MM1]
connect_bd_intf_net [get_bd_intf_pins axi_smc_1/S01_AXI] [get_bd_intf_pins mipi/M_AXI_S2MM2]
connect_bd_intf_net [get_bd_intf_pins axi_smc_1/S02_AXI] [get_bd_intf_pins mipi/M_AXI_S2MM3]
connect_bd_intf_net [get_bd_intf_pins axi_smc/S01_AXI] [get_bd_intf_pins mipi/M_AXI_S2MM4]
connect_bd_intf_net [get_bd_intf_pins axi_smc/S00_AXI] [get_bd_intf_pins mipi/M_AXI_S2MM5]
connect_bd_intf_net [get_bd_intf_pins axi_smc/S02_AXI] [get_bd_intf_pins mipi/M_AXI_S2MM6]
connect_bd_intf_net [get_bd_intf_pins axi_smc/S03_AXI] [get_bd_intf_pins mipi/M_AXI_S2MM7]
connect_bd_intf_net [get_bd_intf_pins axi_smc/S04_AXI] [get_bd_intf_pins mipi/M_AXI_S2MM8]
connect_bd_intf_net [get_bd_intf_pins axi_smc/S05_AXI] [get_bd_intf_pins mipi/M_AXI_S2MM9]
connect_bd_intf_net [get_bd_intf_pins axi_smc/S06_AXI] [get_bd_intf_pins mipi/M_AXI_S2MM10]
connect_bd_intf_net [get_bd_intf_ports mipi_phy_if_0] [get_bd_intf_pins mipi/mipi_phy_if_0]
connect_bd_intf_net [get_bd_intf_ports mipi_phy_if_1] [get_bd_intf_pins mipi/mipi_phy_if_1]
connect_bd_intf_net [get_bd_intf_ports mipi_phy_if_2] [get_bd_intf_pins mipi/mipi_phy_if_2]
connect_bd_intf_net [get_bd_intf_ports mipi_phy_if_3] [get_bd_intf_pins mipi/mipi_phy_if_3]
connect_bd_intf_net [get_bd_intf_ports mipi_phy_if_4] [get_bd_intf_pins mipi/mipi_phy_if_4]
connect_bd_intf_net [get_bd_intf_ports mipi_phy_if_5] [get_bd_intf_pins mipi/mipi_phy_if_5]
connect_bd_intf_net [get_bd_intf_pins ps8_0_axi_periph/M00_AXI] [get_bd_intf_pins mipi/S_AXI_LITE5]
connect_bd_intf_net [get_bd_intf_pins ps8_0_axi_periph/M01_AXI] [get_bd_intf_pins mipi/S_AXI_LITE]
connect_bd_intf_net [get_bd_intf_pins ps8_0_axi_periph/M02_AXI] [get_bd_intf_pins mipi/S_AXI2]
connect_bd_intf_net [get_bd_intf_pins ps8_0_axi_periph/M03_AXI] [get_bd_intf_pins mipi/S_AXI]
connect_bd_intf_net [get_bd_intf_pins ps8_0_axi_periph/M04_AXI] [get_bd_intf_pins mipi/S_AXI1]
connect_bd_intf_net [get_bd_intf_pins ps8_0_axi_periph/M05_AXI] [get_bd_intf_pins mipi/S_AXI8]
connect_bd_intf_net [get_bd_intf_pins ps8_0_axi_periph/M06_AXI] [get_bd_intf_pins mipi/S_AXI10]
connect_bd_intf_net [get_bd_intf_pins ps8_0_axi_periph/M07_AXI] [get_bd_intf_pins mipi/S_AXI12]
connect_bd_intf_net [get_bd_intf_pins ps8_0_axi_periph/M08_AXI] [get_bd_intf_pins mipi/S_AXI6]
connect_bd_intf_net [get_bd_intf_pins ps8_0_axi_periph/M09_AXI] [get_bd_intf_pins user_i2c/S_AXI2]
connect_bd_intf_net [get_bd_intf_pins ps8_0_axi_periph/M10_AXI] [get_bd_intf_pins user_i2c/S_AXI]
connect_bd_intf_net [get_bd_intf_pins ps8_0_axi_periph/M11_AXI] [get_bd_intf_pins user_i2c/S_AXI1]
connect_bd_intf_net [get_bd_intf_pins ps8_0_axi_periph/M12_AXI] [get_bd_intf_pins mipi/S_AXI_LITE2]
connect_bd_intf_net [get_bd_intf_pins ps8_0_axi_periph/M13_AXI] [get_bd_intf_pins mipi/S_AXI_LITE3]
connect_bd_intf_net [get_bd_intf_pins ps8_0_axi_periph/M14_AXI] [get_bd_intf_pins mipi/S_AXI_LITE4]
connect_bd_intf_net [get_bd_intf_pins ps8_0_axi_periph/M15_AXI] [get_bd_intf_pins mipi/S_AXI_LITE1]
connect_bd_intf_net [get_bd_intf_pins ps8_0_axi_periph/M16_AXI] [get_bd_intf_pins mipi/S_AXI_LITE6]
connect_bd_intf_net [get_bd_intf_pins ps8_0_axi_periph/M17_AXI] [get_bd_intf_pins mipi/S_AXI_LITE7]
connect_bd_intf_net [get_bd_intf_pins ps8_0_axi_periph/M18_AXI] [get_bd_intf_pins mipi/S_AXI_LITE8]
connect_bd_intf_net [get_bd_intf_pins ps8_0_axi_periph/M19_AXI] [get_bd_intf_pins mipi/S_AXI_LITE9]
connect_bd_intf_net [get_bd_intf_pins ps8_0_axi_periph/M20_AXI] [get_bd_intf_pins mipi/S_AXI_LITE10]
connect_bd_intf_net [get_bd_intf_pins ps8_0_axi_periph/M21_AXI] [get_bd_intf_pins mipi/s_axi_ctrl]
connect_bd_intf_net [get_bd_intf_pins ps8_0_axi_periph/M22_AXI] [get_bd_intf_pins mipi/s_axi_ctrl1]
connect_bd_intf_net [get_bd_intf_pins ps8_0_axi_periph/M23_AXI] [get_bd_intf_pins mipi/s_axi_ctrl2]
connect_bd_intf_net [get_bd_intf_pins ps8_0_axi_periph/M24_AXI] [get_bd_intf_pins mipi/s_axi_ctrl3]
connect_bd_intf_net [get_bd_intf_pins ps8_0_axi_periph/M25_AXI] [get_bd_intf_pins mipi/s_axi_ctrl4]
connect_bd_intf_net [get_bd_intf_ports qwiic_rtl_0] [get_bd_intf_pins user_i2c/qwiic_rtl_0]
connect_bd_intf_net [get_bd_intf_ports qwiic_rtl_1] [get_bd_intf_pins user_i2c/qwiic_rtl_1]
connect_bd_intf_net [get_bd_intf_ports qwiic_rtl_2] [get_bd_intf_pins user_i2c/qwiic_rtl_2]
connect_bd_intf_net [get_bd_intf_ports iic_rtl_0] [get_bd_intf_pins zynq_ultra_ps_e_0/IIC_1]
connect_bd_intf_net [get_bd_intf_pins zynq_ultra_ps_e_0/M_AXI_HPM0_LPD] [get_bd_intf_pins ps8_0_axi_periph/S00_AXI]
connect_bd_net [get_bd_pins GPIO/dout] [get_bd_pins zynq_ultra_ps_e_0/emio_gpio_i]
connect_bd_net -net In12_1 [get_bd_pins user_i2c/iic2intc_irpt2] [get_bd_pins interrupts/In6]
connect_bd_net -net In13_1 [get_bd_pins user_i2c/iic2intc_irpt] [get_bd_pins interrupts/In7]
connect_bd_net -net In14_1 [get_bd_pins user_i2c/iic2intc_irpt1] [get_bd_pins interrupts/In14]
connect_bd_net [get_bd_ports GPIO] [get_bd_pins GPIO/GPIO]
connect_bd_net [get_bd_ports USER_DIP] [get_bd_pins GPIO/USER_DIP]
connect_bd_net -net axi_vdma_1_s2mm_introut [get_bd_pins mipi/s2mm_introut] [get_bd_pins interrupts/In9]
connect_bd_net -net axi_vdma_2_s2mm_introut1 [get_bd_pins mipi/s2mm_introut2] [get_bd_pins interrupts/In10]
connect_bd_net -net axi_vdma_3_s2mm_introut [get_bd_pins mipi/s2mm_introut3] [get_bd_pins interrupts/In11]
connect_bd_net -net axi_vdma_4_s2mm_introut [get_bd_pins mipi/s2mm_introut4] [get_bd_pins interrupts/In12]
connect_bd_net -net axi_vdma_5_s2mm_introut [get_bd_pins mipi/s2mm_introut1] [get_bd_pins interrupts/In13]
connect_bd_net -net cam2_mipi_block_two_lane_iic2intc_irpt [get_bd_pins mipi/iic2intc_irpt5] [get_bd_pins interrupts/In2]
connect_bd_net -net cam_enable_slice_Dout [get_bd_pins GPIO/ENABLE] [get_bd_ports ENABLE]
connect_bd_net -net cam_iic_1_iic2intc_irpt [get_bd_pins mipi/iic2intc_irpt] [get_bd_pins interrupts/In1]
connect_bd_net -net cam_iic_3_iic2intc_irpt [get_bd_pins mipi/iic2intc_irpt6] [get_bd_pins interrupts/In3]
connect_bd_net -net cam_iic_4_iic2intc_irpt [get_bd_pins mipi/iic2intc_irpt7] [get_bd_pins interrupts/In4]
connect_bd_net -net cam_iic_5_iic2intc_irpt [get_bd_pins mipi/iic2intc_irpt4] [get_bd_pins interrupts/In5]
connect_bd_net -net gpio_trigger_slice_Dout [get_bd_pins mipi/TRIG1] \
  [get_bd_ports TRIG1] [get_bd_ports TRIG5] [get_bd_ports TRIG4] [get_bd_ports TRIG3] [get_bd_ports TRIG2] \
  [get_bd_ports TRIG0] [get_bd_pins Debug/TRIG0]
connect_bd_net -net interrupts_dout [get_bd_pins interrupts/irq0] [get_bd_pins zynq_ultra_ps_e_0/pl_ps_irq0]
connect_bd_net -net mipi_block_four_lane_frame_rcvd_pulse_out [get_bd_pins mipi/frame_rcvd_pulse_out] [get_bd_pins Debug/Op2]
connect_bd_net -net mipi_block_four_lane_s2mm_introut [get_bd_pins mipi/s2mm_introut5] [get_bd_pins interrupts/In8]
connect_bd_net [get_bd_pins mipi/clkoutphy_out] [get_bd_pins axi_smc_1/aclk1]
connect_bd_net -net mipi_csi2_rx_subsyst_0_video_out_tuser [get_bd_pins mipi/video_out_tuser] [get_bd_pins Debug/Op1]
connect_bd_net [get_bd_pins mipi/dout] \
  [get_bd_pins axi_smc_1/S01_AXI_awprot] [get_bd_pins axi_smc_1/S02_AXI_awprot] [get_bd_pins axi_smc_1/S03_AXI_awprot] \
  [get_bd_pins axi_smc_1/S00_AXI_awprot] [get_bd_pins axi_smc/S01_AXI_awprot] [get_bd_pins axi_smc/S00_AXI_awprot]
connect_bd_net [get_bd_pins mipi/dout1] \
  [get_bd_pins axi_smc_1/S01_AXI_awcache] [get_bd_pins axi_smc_1/S02_AXI_awcache] [get_bd_pins axi_smc_1/S03_AXI_awcache] \
  [get_bd_pins axi_smc_1/S00_AXI_awcache] [get_bd_pins axi_smc/S01_AXI_awcache] [get_bd_pins axi_smc/S00_AXI_awcache]
connect_bd_net [get_bd_pins mipi/interrupt6] [get_bd_pins interrupts/In0]
connect_bd_net [get_bd_pins rst_ps8_0_100M/interconnect_aresetn] [get_bd_pins mipi/aresetn]
connect_bd_net -net rst_ps8_0_49M_peripheral_aresetn [get_bd_pins rst_ps8_0_100M/peripheral_aresetn] \
  [get_bd_pins mipi/video_aresetn] [get_bd_pins user_i2c/s_axi_aresetn] [get_bd_pins Debug/resetn] \
  [get_bd_pins ps8_0_axi_periph/ARESETN] [get_bd_pins ps8_0_axi_periph/S00_ARESETN] \
  [get_bd_pins ps8_0_axi_periph/M00_ARESETN] [get_bd_pins ps8_0_axi_periph/M01_ARESETN] \
  [get_bd_pins ps8_0_axi_periph/M02_ARESETN] [get_bd_pins ps8_0_axi_periph/M03_ARESETN] \
  [get_bd_pins ps8_0_axi_periph/M04_ARESETN] [get_bd_pins ps8_0_axi_periph/M05_ARESETN] \
  [get_bd_pins ps8_0_axi_periph/M06_ARESETN] [get_bd_pins ps8_0_axi_periph/M07_ARESETN] \
  [get_bd_pins ps8_0_axi_periph/M08_ARESETN] [get_bd_pins ps8_0_axi_periph/M09_ARESETN] \
  [get_bd_pins ps8_0_axi_periph/M10_ARESETN] [get_bd_pins ps8_0_axi_periph/M11_ARESETN] \
  [get_bd_pins ps8_0_axi_periph/M12_ARESETN] [get_bd_pins ps8_0_axi_periph/M13_ARESETN] \
  [get_bd_pins ps8_0_axi_periph/M14_ARESETN] [get_bd_pins ps8_0_axi_periph/M15_ARESETN] [get_bd_pins axi_smc_1/aresetn] \
  [get_bd_pins axi_smc/aresetn] [get_bd_pins ps8_0_axi_periph/M16_ARESETN] [get_bd_pins ps8_0_axi_periph/M17_ARESETN] \
  [get_bd_pins ps8_0_axi_periph/M18_ARESETN] [get_bd_pins ps8_0_axi_periph/M19_ARESETN] \
  [get_bd_pins ps8_0_axi_periph/M20_ARESETN] [get_bd_pins ps8_0_axi_periph/M21_ARESETN] \
  [get_bd_pins ps8_0_axi_periph/M22_ARESETN] [get_bd_pins ps8_0_axi_periph/M23_ARESETN] \
  [get_bd_pins ps8_0_axi_periph/M24_ARESETN] [get_bd_pins ps8_0_axi_periph/M25_ARESETN]
connect_bd_net -net trigger_probe_inverter_Res [get_bd_pins Debug/TRIG_PROBE] [get_bd_ports TRIG_PROBE]
connect_bd_net -net user_led_slice_Dout [get_bd_pins GPIO/USER_LEDS] [get_bd_ports USER_LEDS]
connect_bd_net -net util_vector_logic_2_Res [get_bd_pins Debug/FRAME_START_0] [get_bd_ports FRAME_START_0]
connect_bd_net -net util_vector_logic_3_Res [get_bd_pins Debug/FRAME_END_0] [get_bd_ports FRAME_END_0]
connect_bd_net -net xlconcat_1_dout [get_bd_pins interrupts/irq1] [get_bd_pins zynq_ultra_ps_e_0/pl_ps_irq1]
connect_bd_net [get_bd_pins zynq_ultra_ps_e_0/emio_gpio_o] [get_bd_pins GPIO/Din] [get_bd_pins mipi/Din]
connect_bd_net [get_bd_pins zynq_ultra_ps_e_0/emio_gpio_t] [get_bd_pins GPIO/Din1]
connect_bd_net [get_bd_pins zynq_ultra_ps_e_0/pl_clk0] [get_bd_pins mipi/dphy_clk_200M]
connect_bd_net [get_bd_pins zynq_ultra_ps_e_0/pl_clk1] \
  [get_bd_pins rst_ps8_0_100M/slowest_sync_clk] [get_bd_pins mipi/video_aclk] [get_bd_pins user_i2c/s_axi_aclk] \
  [get_bd_pins Debug/CLK] [get_bd_pins ps8_0_axi_periph/ACLK] [get_bd_pins ps8_0_axi_periph/S00_ACLK] \
  [get_bd_pins ps8_0_axi_periph/M00_ACLK] [get_bd_pins ps8_0_axi_periph/M01_ACLK] [get_bd_pins ps8_0_axi_periph/M02_ACLK] \
  [get_bd_pins ps8_0_axi_periph/M03_ACLK] [get_bd_pins ps8_0_axi_periph/M04_ACLK] [get_bd_pins ps8_0_axi_periph/M05_ACLK] \
  [get_bd_pins ps8_0_axi_periph/M06_ACLK] [get_bd_pins ps8_0_axi_periph/M07_ACLK] [get_bd_pins ps8_0_axi_periph/M08_ACLK] \
  [get_bd_pins ps8_0_axi_periph/M09_ACLK] [get_bd_pins ps8_0_axi_periph/M10_ACLK] [get_bd_pins ps8_0_axi_periph/M11_ACLK] \
  [get_bd_pins ps8_0_axi_periph/M12_ACLK] [get_bd_pins ps8_0_axi_periph/M13_ACLK] [get_bd_pins ps8_0_axi_periph/M14_ACLK] \
  [get_bd_pins ps8_0_axi_periph/M15_ACLK] [get_bd_pins zynq_ultra_ps_e_0/maxihpm0_lpd_aclk] \
  [get_bd_pins zynq_ultra_ps_e_0/saxihpc0_fpd_aclk] [get_bd_pins zynq_ultra_ps_e_0/saxihpc1_fpd_aclk] \
  [get_bd_pins axi_smc_1/aclk] [get_bd_pins axi_smc/aclk] [get_bd_pins ps8_0_axi_periph/M16_ACLK] \
  [get_bd_pins ps8_0_axi_periph/M17_ACLK] [get_bd_pins ps8_0_axi_periph/M18_ACLK] [get_bd_pins ps8_0_axi_periph/M19_ACLK] \
  [get_bd_pins ps8_0_axi_periph/M20_ACLK] [get_bd_pins ps8_0_axi_periph/M21_ACLK] [get_bd_pins ps8_0_axi_periph/M22_ACLK] \
  [get_bd_pins ps8_0_axi_periph/M23_ACLK] [get_bd_pins ps8_0_axi_periph/M24_ACLK] [get_bd_pins ps8_0_axi_periph/M25_ACLK]
connect_bd_net [get_bd_pins zynq_ultra_ps_e_0/pl_resetn0] [get_bd_pins rst_ps8_0_100M/ext_reset_in]
